# EAGLE design acdimmer-revB (EAGLE 9.4.0)
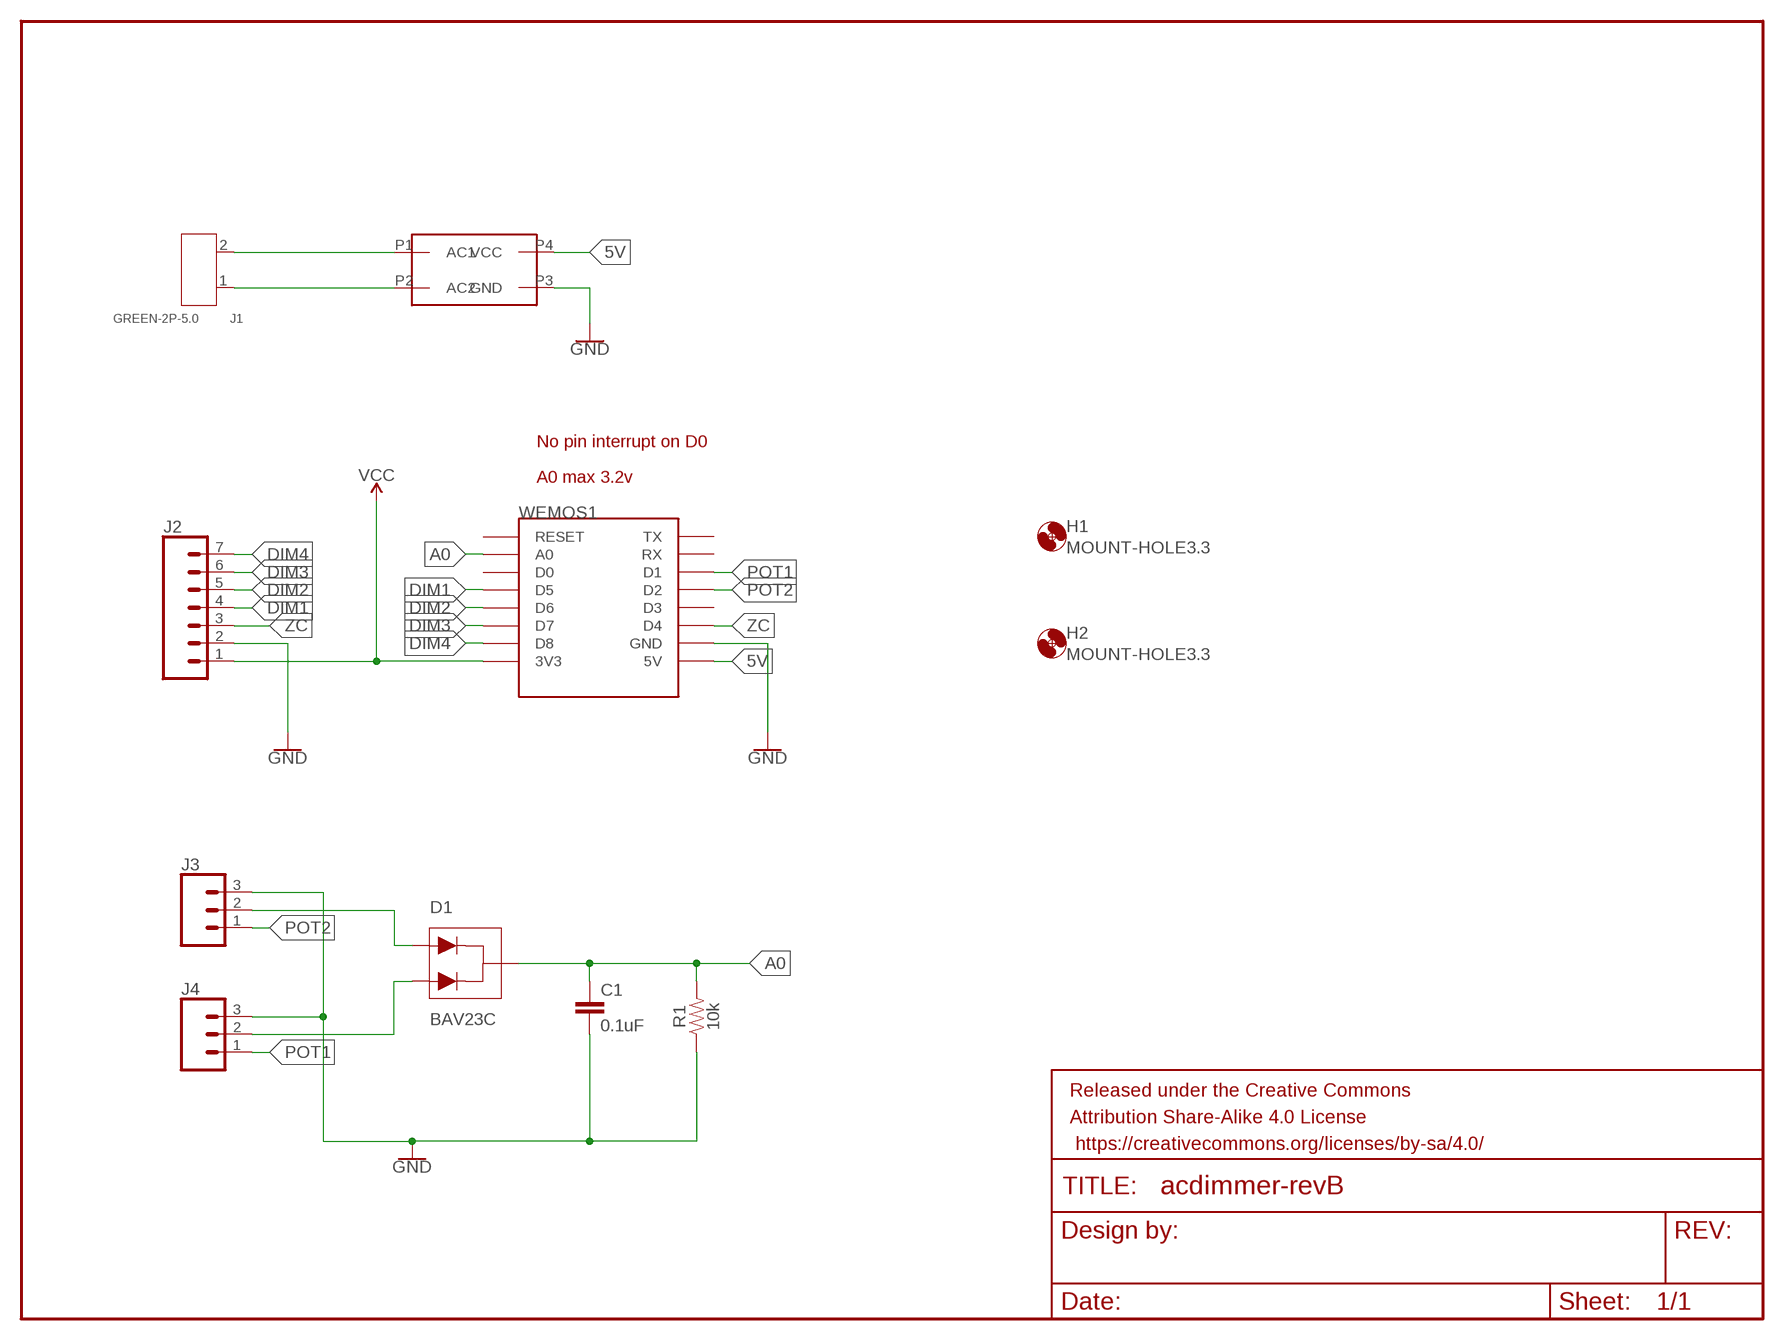
[diagram p0: schematic, sheet 1]

## Parts
C1  0.1uF  0.1UF-0603-25V-5%  [0603]
D1  BAV23C  [SOT23-3]
FRAME1  FRAME-LETTERNO_PACKAGE  [DUMMY]
H1  MOUNT-HOLE3.3  [3,3]
H2  MOUNT-HOLE3.3  [3,3]
J1  GREEN-2P-5.0  SCREW-TERMINAL-GREEN(2P-5.0)  [H2-5.0-10.5X8.0MM]
J2  CONN_07NO_SILK  [1X07_NO_SILK]
J3  CONN_03SCREW  [SCREWTERMINAL-3.5MM-3]
J4  CONN_03SCREW  [SCREWTERMINAL-3.5MM-3]
R1  10k  10KOHM-0603-1/10W-1%  [0603]
U$1  ACDC5V  [ACDC5V]
WEMOS1  WEMOS-D1-MINI  [WEMOS-D1-MINI]

## Nets
5V: U$1.P4(VCC) WEMOS1.5V
A0: C1.1 D1.3(C) R1.2 WEMOS1.A0
DIM1: J2.4 WEMOS1.D5
DIM2: J2.5 WEMOS1.D6
DIM3: J2.6 WEMOS1.D7
DIM4: J2.7 WEMOS1.D8
GND: C1.2 J2.2 J3.3 J4.3 R1.1 U$1.P3(GND) WEMOS1.GND
N$1: J1.2 U$1.P1(AC1)
N$2: J1.1 U$1.P2(AC2)
N$3: D1.1(A1) J3.2
N$4: D1.2(A2) J4.2
POT1: J4.1 WEMOS1.D1
POT2: J3.1 WEMOS1.D2
VCC: J2.1 WEMOS1.3V3
ZC: J2.3 WEMOS1.D4
Unconnected: WEMOS1.D0 WEMOS1.D3 WEMOS1.RESET WEMOS1.RX WEMOS1.TX

## Notes on the sheet
- No pin interrupt on D0
- A0 max 3.2v

## Library data of the parts
C1 = SparkFun-Capacitors:0.1UF: 0.1µF ceramic capacitors A capacitor is a passive two-terminal electrical component used to store electrical energy temporarily in an electric field.; PROD_ID: CAP-08604
D1 = SparkFun-DiscreteSemi:BAV23C
FRAME1 = SparkFun-Aesthetics:FRAME-LETTER: Schematic Frame - Letter Standard 8.5x11 US Letter frame; DESIGNER: Nobody; VERSION: v01
H1 H2 = holes:MOUNT-HOLE: MOUNTING HOLE with drill center marker
J1 = OPL_Connector:SCREW-TERMINAL-GREEN(2P-5.0): 320110031
J2 = SparkFun-Connectors:CONN_07: Multi connection point. Often used as Generic Header-pin footprint for 0.1 inch spaced/style header connections On any of the 0.1 inch spaced packages, you can populate with these: Break Away Headers - Straight <https://www.sparkfun.com/products/116> (PRT-00116) Break Away Male Headers - Right Angle <https://www.sparkfun.com/products/553> (PRT-00553) Female Headers <https://www.sparkfun.com/products/115> (PRT-00115) Break Away Headers - Machine Pin <https://www.sparkfun.com/products/117> (PRT-00117) Break Away Female Headers - Swiss Machine Pin <https://www.sparkfun.com/products/743> (PRT-00743) For SCREWTERMINALS and SPRING TERMINALS visit here: Screw Terimnals on SparkFun.com <https://www.sparkfun.com/search/results?term=Screw+Terminals> (5mm/3.5mm/2.54mm spacing) This device is also useful as a general connection point to wire up your design to another part of your project. Our various solder wires solder well into these plated through hole pads. Hook-Up Wire - Assortment (Stranded, 22 AWG) <https://www.sparkfun.com/products/11375> (PRT-11375) Hook-Up Wire - Assortment (Solid Core, 22 AWG) <https://www.sparkfun.com/products/11367> (PRT-11367) View the entire wire category on our website here <https://www.sparkfun.com/categories/141> Special notes: Molex polarized connector foot print use with SKU : PRT-08231 with associated crimp pins and housings. 1MM SMD Version SKU: PRT-10208 NOTES ON THE VARIANTS LOCK and LOCK_LONGPADS... This footprint was designed to help hold the alignment of a through-hole component (i.e. 6-pin header) while soldering it into place. You may notice that each hole has been shifted either up or down by 0.005 of an inch from it's more standard position (which is a perfectly straight line). This slight alteration caused the pins (the squares in the middle) to touch the edges of the holes. Because they are alternating, it causes a "brace" to hold the component in place. 0.005 has proven to be the perfect amount of "off-center" position when using our standard breakaway headers. Although looks a little odd when you look at the bare footprint, once you have a header in there, the alteration is very hard to notice. Also,if you push a header all the way into place, it is covered up entirely on the bottom side.
J3 J4 = SparkFun-Connectors:CONN_03: Multi connection point. Often used as Generic Header-pin footprint for 0.1 inch spaced/style header connections On any of the 0.1 inch spaced packages, you can populate with these: Break Away Headers - Straight <https://www.sparkfun.com/products/116> (PRT-00116) Break Away Male Headers - Right Angle <https://www.sparkfun.com/products/553> (PRT-00553) Female Headers <https://www.sparkfun.com/products/115> (PRT-00115) Break Away Headers - Machine Pin <https://www.sparkfun.com/products/117> (PRT-00117) Break Away Female Headers - Swiss Machine Pin <https://www.sparkfun.com/products/743> (PRT-00743) Stackable Header - 3 Pin (Female, 0.1") <https://www.sparkfun.com/products/13875> (PRT-13875) For SCREWTERMINALS and SPRING TERMINALS visit here: Screw Terimnals on SparkFun.com <https://www.sparkfun.com/search/results?term=Screw+Terminals> (5mm/3.5mm/2.54mm spacing) This device is also useful as a general connection point to wire up your design to another part of your project. Our various solder wires solder well into these plated through hole pads. Hook-Up Wire - Assortment (Stranded, 22 AWG) <https://www.sparkfun.com/products/11375> (PRT-11375) Hook-Up Wire - Assortment (Solid Core, 22 AWG) <https://www.sparkfun.com/products/11367> (PRT-11367) View the entire wire category on our website here <https://www.sparkfun.com/categories/141> Special notes: Molex polarized connector foot print use with SKU : PRT-08232 with associated crimp pins and housings.; PROD_ID: CONN-08288; SF_ID: PRT-08235
R1 = SparkFun-Resistors:10KOHM: 10kΩ resistor A resistor is a passive two-terminal electrical component that implements electrical resistance as a circuit element. Resistors act to reduce current flow, and, at the same time, act to lower voltage levels within circuits. - Wikipedia; PROD_ID: RES-00824
U$1 = shlomo:ACDC5V
WEMOS1 = esp8266modules:WEMOS-D1-MINI: WeMos.cc D1 mini ESP8266 module

## Board
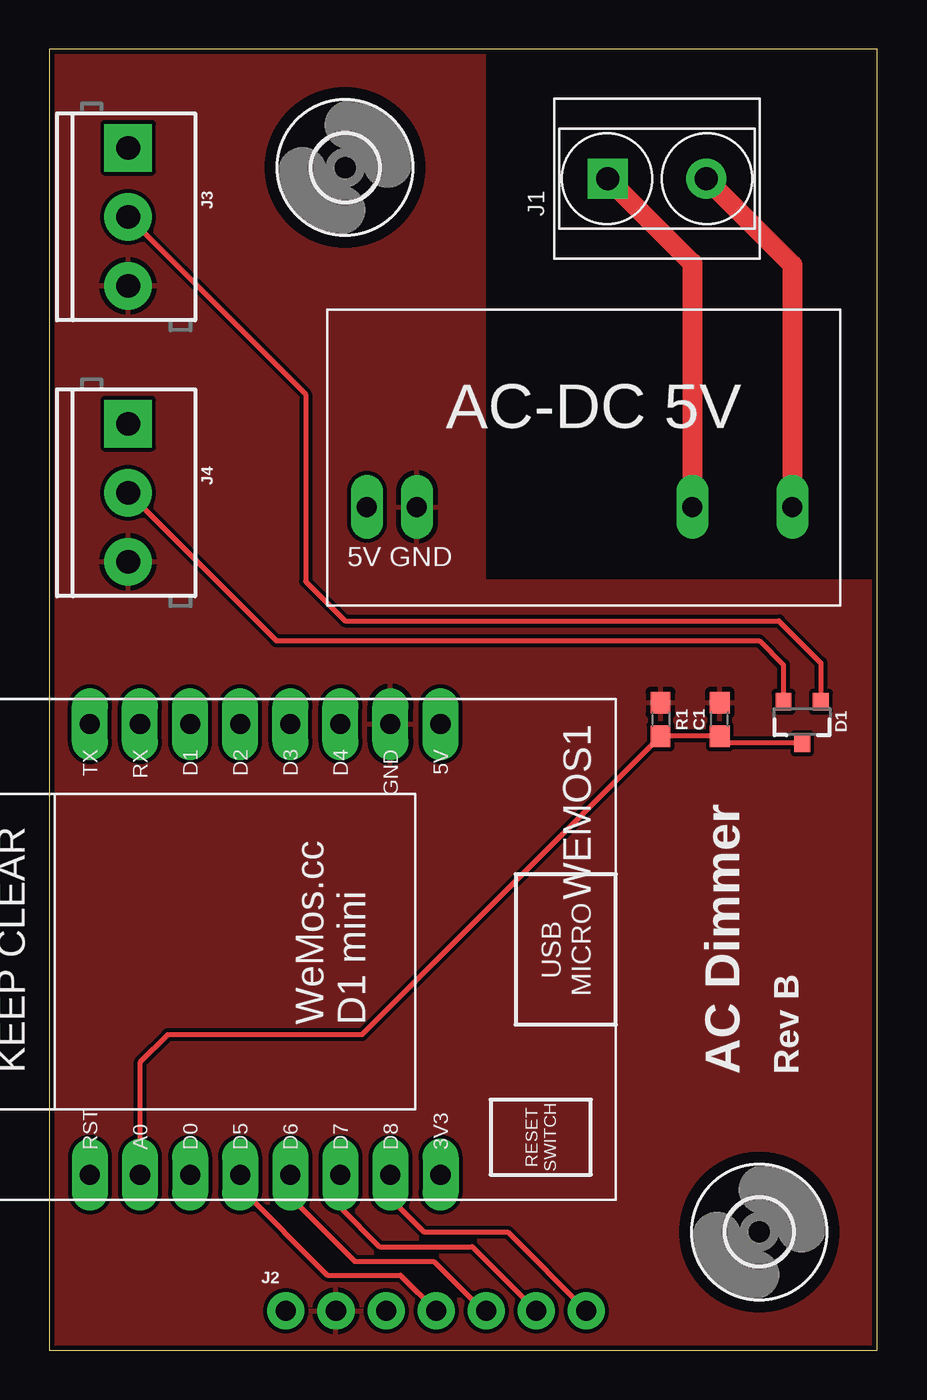
[diagram p1: board, top side]
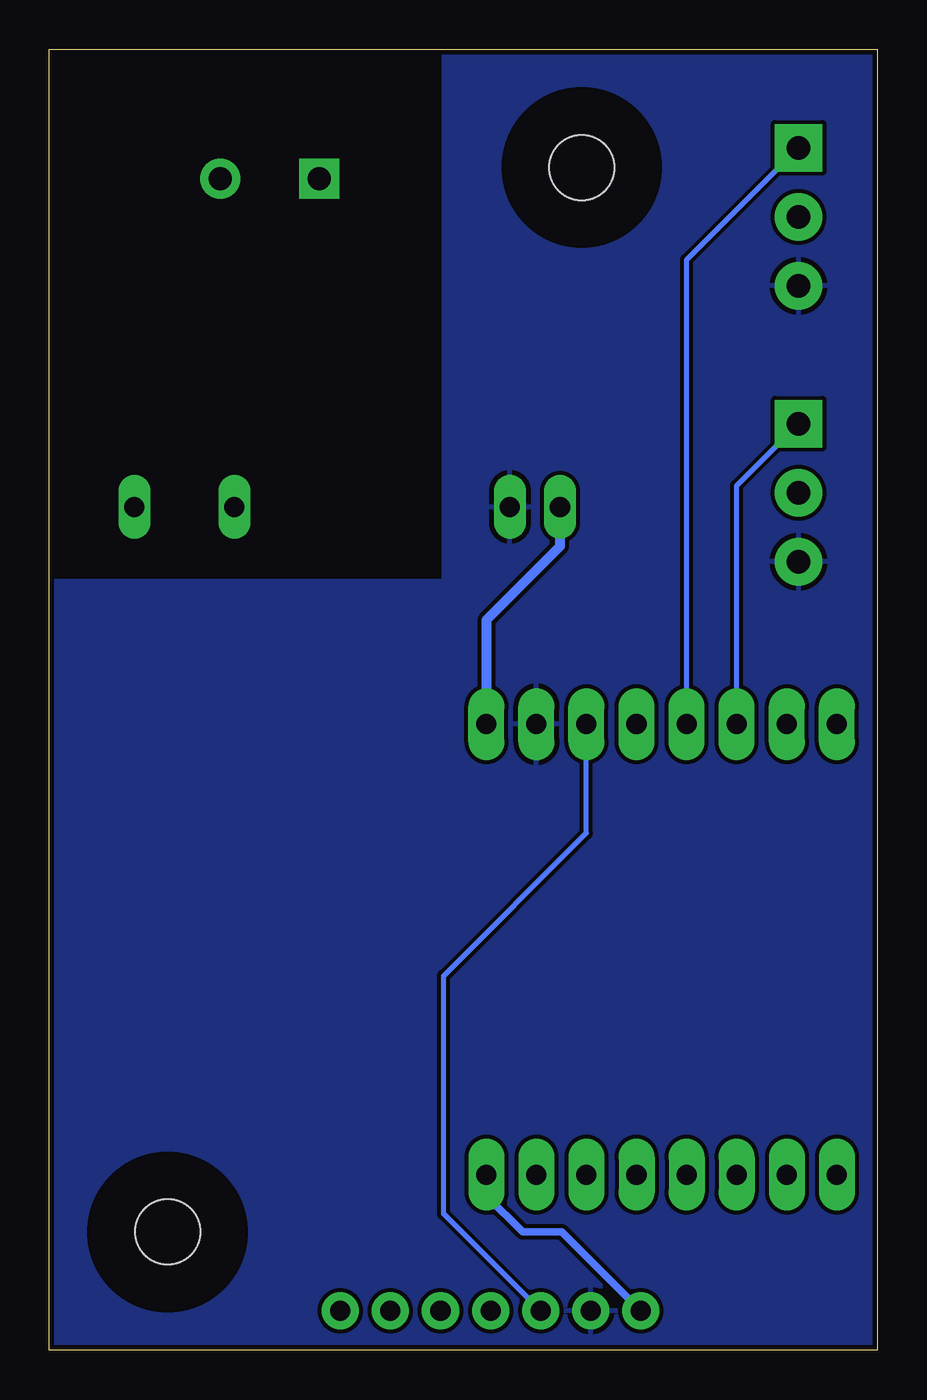
[diagram p2: board, bottom side, seen from below]

Size 42 x 66 mm. Coordinates in mm from the lower left corner, seen from the top.
Outline: 0,0 42,0 42,66 0,66 0,0
Copper layers (1*16): Top 0.035mm / dielectric 1.5mm / Bottom 0.035mm
Design rules "SparkFun": minimum track width 8mil, minimum drill 20mil, track to track 8mil, track to pad 8mil, pad to pad 8mil, via to via 8mil, smd to smd 8mil, copper to edge 10mil, drill to drill 8mil, minimum pad ring 12mil, minimum via ring 10mil, stop-mask expansion 4mil, vias tented up to drill 25mil, thermal gap 10mil

### Footprints (pad centres in the part's own frame; a part is rotated, then mirrored left to right if it is on the bottom)
0603 = smd 1.1 x 1: 1 -0.85,0; 2 0.85,0
SOT23-3 = smd 0.8 x 0.9: 1 -0.95,-1; 2 0.95,-1; 3 0,1.1
3,3 = hole 3.3: 0,0
H2-5.0-10.5X8.0MM = drill 1.168 pad 2.032 square: 1 0,2.5 | drill 1.168 pad 2.032: 2 0,-2.5
1X07_NO_SILK = drill 1.016 pad 1.88: 1 0,0; 2 2.54,0; 3 5.08,0; 4 7.62,0; 5 10.16,0; 6 12.7,0; 7 15.24,0
SCREWTERMINAL-3.5MM-3 = drill 1.2 pad 2.413 square: 1 0,0 | drill 1.2 pad 2.413: 2 3.5,0; 3 7,0
ACDC5V = drill 1.016 long: P1 0,21.59; P2 0,16.51; P3 0,2.54; P4 0,0
WEMOS-D1-MINI = drill 1.016 pad 1.829 long: 3V3 -10.16,-10.16; 5V 12.7,-10.16; A0 -10.16,5.08; D0 -10.16,2.54; D1 12.7,2.54; D2 12.7,0; D3 12.7,-2.54; D4 12.7,-5.08; D5 -10.16,0; D6 -10.16,-2.54; D7 -10.16,-5.08; D8 -10.16,-7.62; GND 12.7,-7.62; RESET -10.16,7.62; RX 12.7,5.08; TX 12.7,7.62

### Placement (x,y rotation side)
C1  34,32 90 top
D1  38.18,31.9 180 top
FRAME1  -5,0 0 top  (outside the outline)
H1  36,6 0 top
H2  15,60 0 top
J1  30.82,59.44 90 top
J2  12,2 0 top
J3  4,61 270 top
J4  4,47 270 top
R1  31,32 270 top
U$1  16.1,42.78 270 top
WEMOS1  9.68,19.06 90 top

### Tracks (layer width: path | path; a pad name or v marks a point on that pad's centre or on a via)
5V
  Bottom 0.508: U$1.P4 16.1,40.78 19.84,37.04 WEMOS1.5V
A0
  Top 0.254: D1.3 34.35,30.8 C1.1 R1.2 15.85,16 6,16 4.6,14.6 WEMOS1.A0
DIM1
  Top 0.254: WEMOS1.D5 9.68,8.23 14.1,3.81 17.81,3.81 J2.4
DIM2
  Top 0.254: WEMOS1.D6 12.22,7.78 15.49,4.51 19.49,4.51 22,2 J2.5
DIM3
  Top 0.254: WEMOS1.D7 14.76,7.24 16.75,5.25 21.45,5.25 J2.6
DIM4
  Top 0.254: WEMOS1.D8 17.3,7.7 19,6 23.24,6 J2.7
GND
  pour Top: -1,67 22,67 22,39 43,39 43,-1 -1,-1
  pour Bottom: -1,67 22,67 22,39 43,39 43,-1 -1,-1
N$1
  Top 1.016: J1.2 37.69,55.07 U$1.P1
N$2
  Top 1.016: J1.1 32.61,55.15 U$1.P2
N$3
  Top 0.254: J3.2 13,48.5 13,39 15,37 37,37 39.13,34.87 D1.1
N$4
  Top 0.254: J4.2 11.5,36 36,36 37.23,34.77 D1.2
POT1
  Bottom 0.254: WEMOS1.D1 7.14,43.86 J4.1
POT2
  Bottom 0.254: WEMOS1.D2 9.68,55.32 J3.1
VCC
  Bottom 0.381: WEMOS1.3V3 19.84,7.84 18,6 16,6 J2.1
ZC
  Bottom 0.254: J2.3 22,6.92 22,19 14.76,26.24 WEMOS1.D4

### Text on the board
tPlace: AC Dimmer | Rev B